# Altium schematic sheet Clock_Led_7_thanh_Huynh_Tan_Cuong.SchDoc
size A3; SheetNumber: 1; SheetTotal: 8
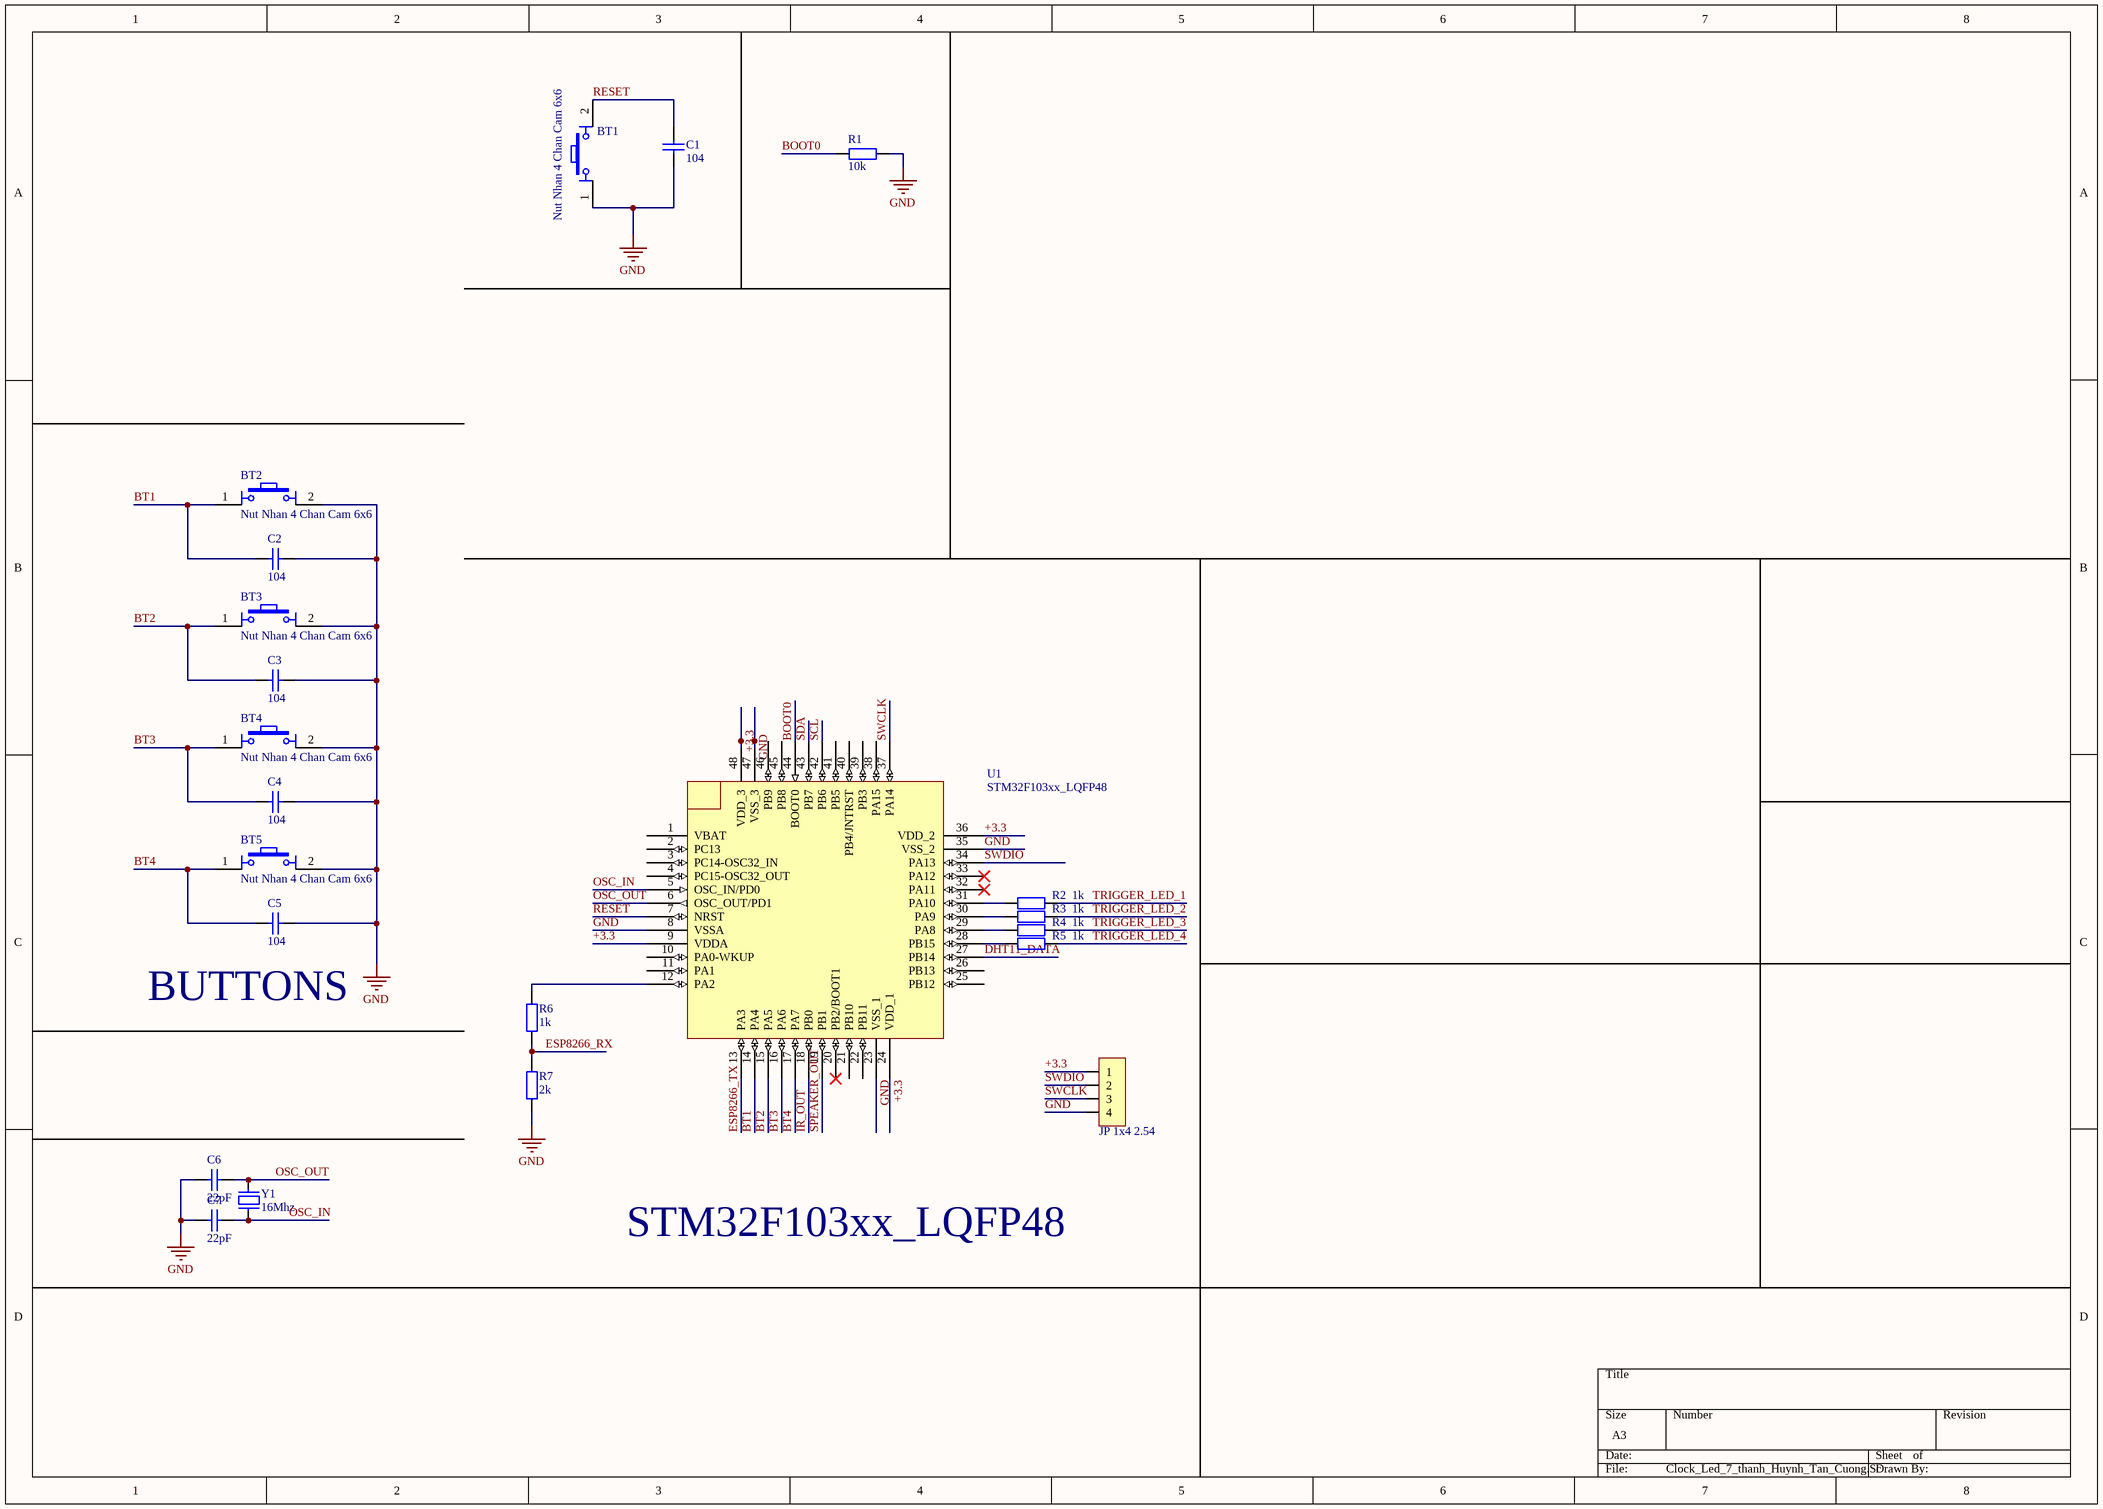
[diagram p0: Clock_Led_7_thanh_Huynh_Tan_Cuong.SchDoc]

## Parts
BT1  Nut Nhan 4 Chan Cam 6x6  [Nut Nhan 4 Chan Cam 6x6]
BT2  Nut Nhan 4 Chan Cam 6x6  [Nut Nhan 4 Chan Cam 6x6]
BT3  Nut Nhan 4 Chan Cam 6x6  [Nut Nhan 4 Chan Cam 6x6]
BT4  Nut Nhan 4 Chan Cam 6x6  [Nut Nhan 4 Chan Cam 6x6]
BT5  Nut Nhan 4 Chan Cam 6x6  [Nut Nhan 4 Chan Cam 6x6]
C1  104  [tu 0603]
C2  104  [tu 0603]
C3  104  [tu 0603]
C4  104  [tu 0603]
C5  104  [tu 0603]
C6  22pF  [tu 0603]
C7  22pF  [tu 0603]
JP1  JP 1x4 2.54  [JP 1x4 DC]
R1  10k  [tro smd 0603]
R2  1k  [tro smd 0603]
R3  1k  [tro smd 0603]
R4  1k  [tro smd 0603]
R5  1k  [tro smd 0603]
R6  1k  [tro smd 0603]
R7  2k  [tro smd 0603]
U1  STM32F103xx_LQFP48  [STM32_LQPF48]
Y1  16Mhz  [Thach Anh 2 chan SMD]

## Nets
GND: BT1.1 BT2.2 BT3.2 BT4.2 BT5.2 C1.2 C2.2 C3.2 C4.2 C5.2 C6.2 C7.2 JP1.4 R1.2 R7.1 U1.8(VSSA) U1.23(VSS_1) U1.35(VSS_2) U1.47(VSS_3)
+3.3: JP1.1 U1.9(VDDA) U1.24(VDD_1) U1.36(VDD_2) U1.48(VDD_3)
BOOT0: R1.1 U1.44(BOOT0)
BT1: BT2.1 C2.1 U1.14(PA4)
BT2: BT3.1 C3.1 U1.15(PA5)
BT3: BT4.1 C4.1 U1.16(PA6)
BT4: BT5.1 C5.1 U1.17(PA7)
DHT11_DATA: U1.27(PB14)
ESP8266_RX: R6.1 R7.2
ESP8266_TX: U1.13(PA3)
IR_OUT: U1.18(PB0)
OSC_IN: C7.1 U1.5(OSC_IN/PD0) Y1.1
OSC_OUT: C6.1 U1.6(OSC_OUT/PD1) Y1.2
RESET: BT1.2 C1.1 U1.7(NRST)
SCL: U1.42(PB6)
SDA: U1.43(PB7)
SPEAKER_OUT: U1.19(PB1)
SWCLK: JP1.3 U1.37(PA14)
SWDIO: JP1.2 U1.34(PA13)
TRIGGER_LED_1: R2.2
TRIGGER_LED_2: R3.2
TRIGGER_LED_3: R4.2
TRIGGER_LED_4: R5.2
NetR2_1: R2.1 U1.31(PA10)
NetR3_1: R3.1 U1.30(PA9)
NetR4_1: R4.1 U1.29(PA8)
NetR5_1: R5.1 U1.28(PB15)
NetR6_2: R6.2 U1.12(PA2)

Not connected (* = marked no-connect by the designer): U1 1(VBAT) 2(PC13) 3(PC14-OSC32_IN) 4(PC15-OSC32_OUT) 10(PA0-WKUP) 11(PA1) 20(PB2/BOOT1)* 21(PB10) 22(PB11) 25(PB12) 26(PB13) 32(PA11)* 33(PA12)* 38(PA15) 39(PB3) 40(PB4/JNTRST) 41(PB5) 45(PB8) 46(PB9)

## Notes on the sheet
- (near C5) BUTTONS
- STM32F103xx_LQFP48

## Library data of the parts
BT1-BT5 = Nut Nhan 4 Chan Cam 6x6: Nut Nhan 4 Chan 6x6mm; Ten: Nút Nhấn 4 Chân 6x6x5MM DIP; Ma_Hang: MH004584
C1-C5 = Tu 0603 104 50V 10%: Dán; Don_Vi: Con; So_Chan: 2; Ten_Linh_Kien: Tụ 0603 104-100nF 10% 50V; Ma_Hang: MH004568; Chung_Loai: Dán; Kieu_Chan: *
C6 C7 = Tu 0603 22pF 50V 10%: Dán; Don_Vi: Con; So_Chan: 2; Ten_Linh_Kien: Tụ 0603 22pF 50V 10%; Ma_Hang: MH004570; Chung_Loai: Dán; Kieu_Chan: *
JP1 = JP 1x4 2.54 Duc Cong: Cắm; Ten_Linh_Kien: Jump Đơn Đực 2.54MM 1x40P Cong Đứng; Don_Vi: Con; Ma_Hang: MH000904; Ghi_Chu: *; Kieu_Chan: *; Chung_Loai: Cắm
R1 = Tro 0603 1% 10k: Dán; Don_Vi: Con; So_Chan: 2; Ten_Linh_Kien: Trở 0603 1% 10k; Ma_Hang: MH006333; Chung_Loai: Dán; Kieu_Chan: *
R2-R6 = Tro 0603 1% 1k: Dán; So_Chan: 2; Don_Vi: Con; Ten_Linh_Kien: Trở 0603 1% 1k; Ma_Hang: MH006334; Chung_Loai: Dán; Kieu_Chan: *
R7 = Tro 0603 5% 2k: Dán; Don_Vi: Con; So_Chan: 2; Ten_Linh_Kien: Trở 0603 5% 2k; Ma_Hang: MH006324; Chung_Loai: Dán; Kieu_Chan: *
Y1 = Thach Anh 2 chan SMD: Crystal For all Crystal 2pin.; Value: 4Mhz
U1 = STM32F103xx_LQFP48: Published: 30-May-2008; DatasheetVersion: rev6, Mar-2008; PackageVersion: Mar-2008; PackageReference: LQFP48; Publisher: Altium Limited; PackageDescription: 48-Pin Low-Profile Quad Flat Pack, 7 x 7 mm Body, 0.5 mm Pitch (LQFP48); ComponentLink1Description: Manufacturer Link; ComponentLink1URL: www.st.com/stm32; ComponentLink2Description: Datasheet; ComponentLink2URL: http://www.st.com/stonline/products/literature/ds/13587.pdf